# Altium schematic sheet car2.SchDoc
size A3; SheetNumber: 0; SheetTotal: 0; PageSetup: Record=PageOptions|CenterHorizontal=True|CenterVertical=True|PrintScale=0.73|XCorrection=1.00|YCorrection=1.00|PrintKind=2|BorderSize=5000000|LeftOffset=0|BottomOffset=0|Orientation=2|PaperLength=1000|PaperWidth=1000|Scale=100|PaperSource=7|PrintQuality=-4|MediaType=1|DitherType=10|PaperKind=A4|PrintScaleMode=1
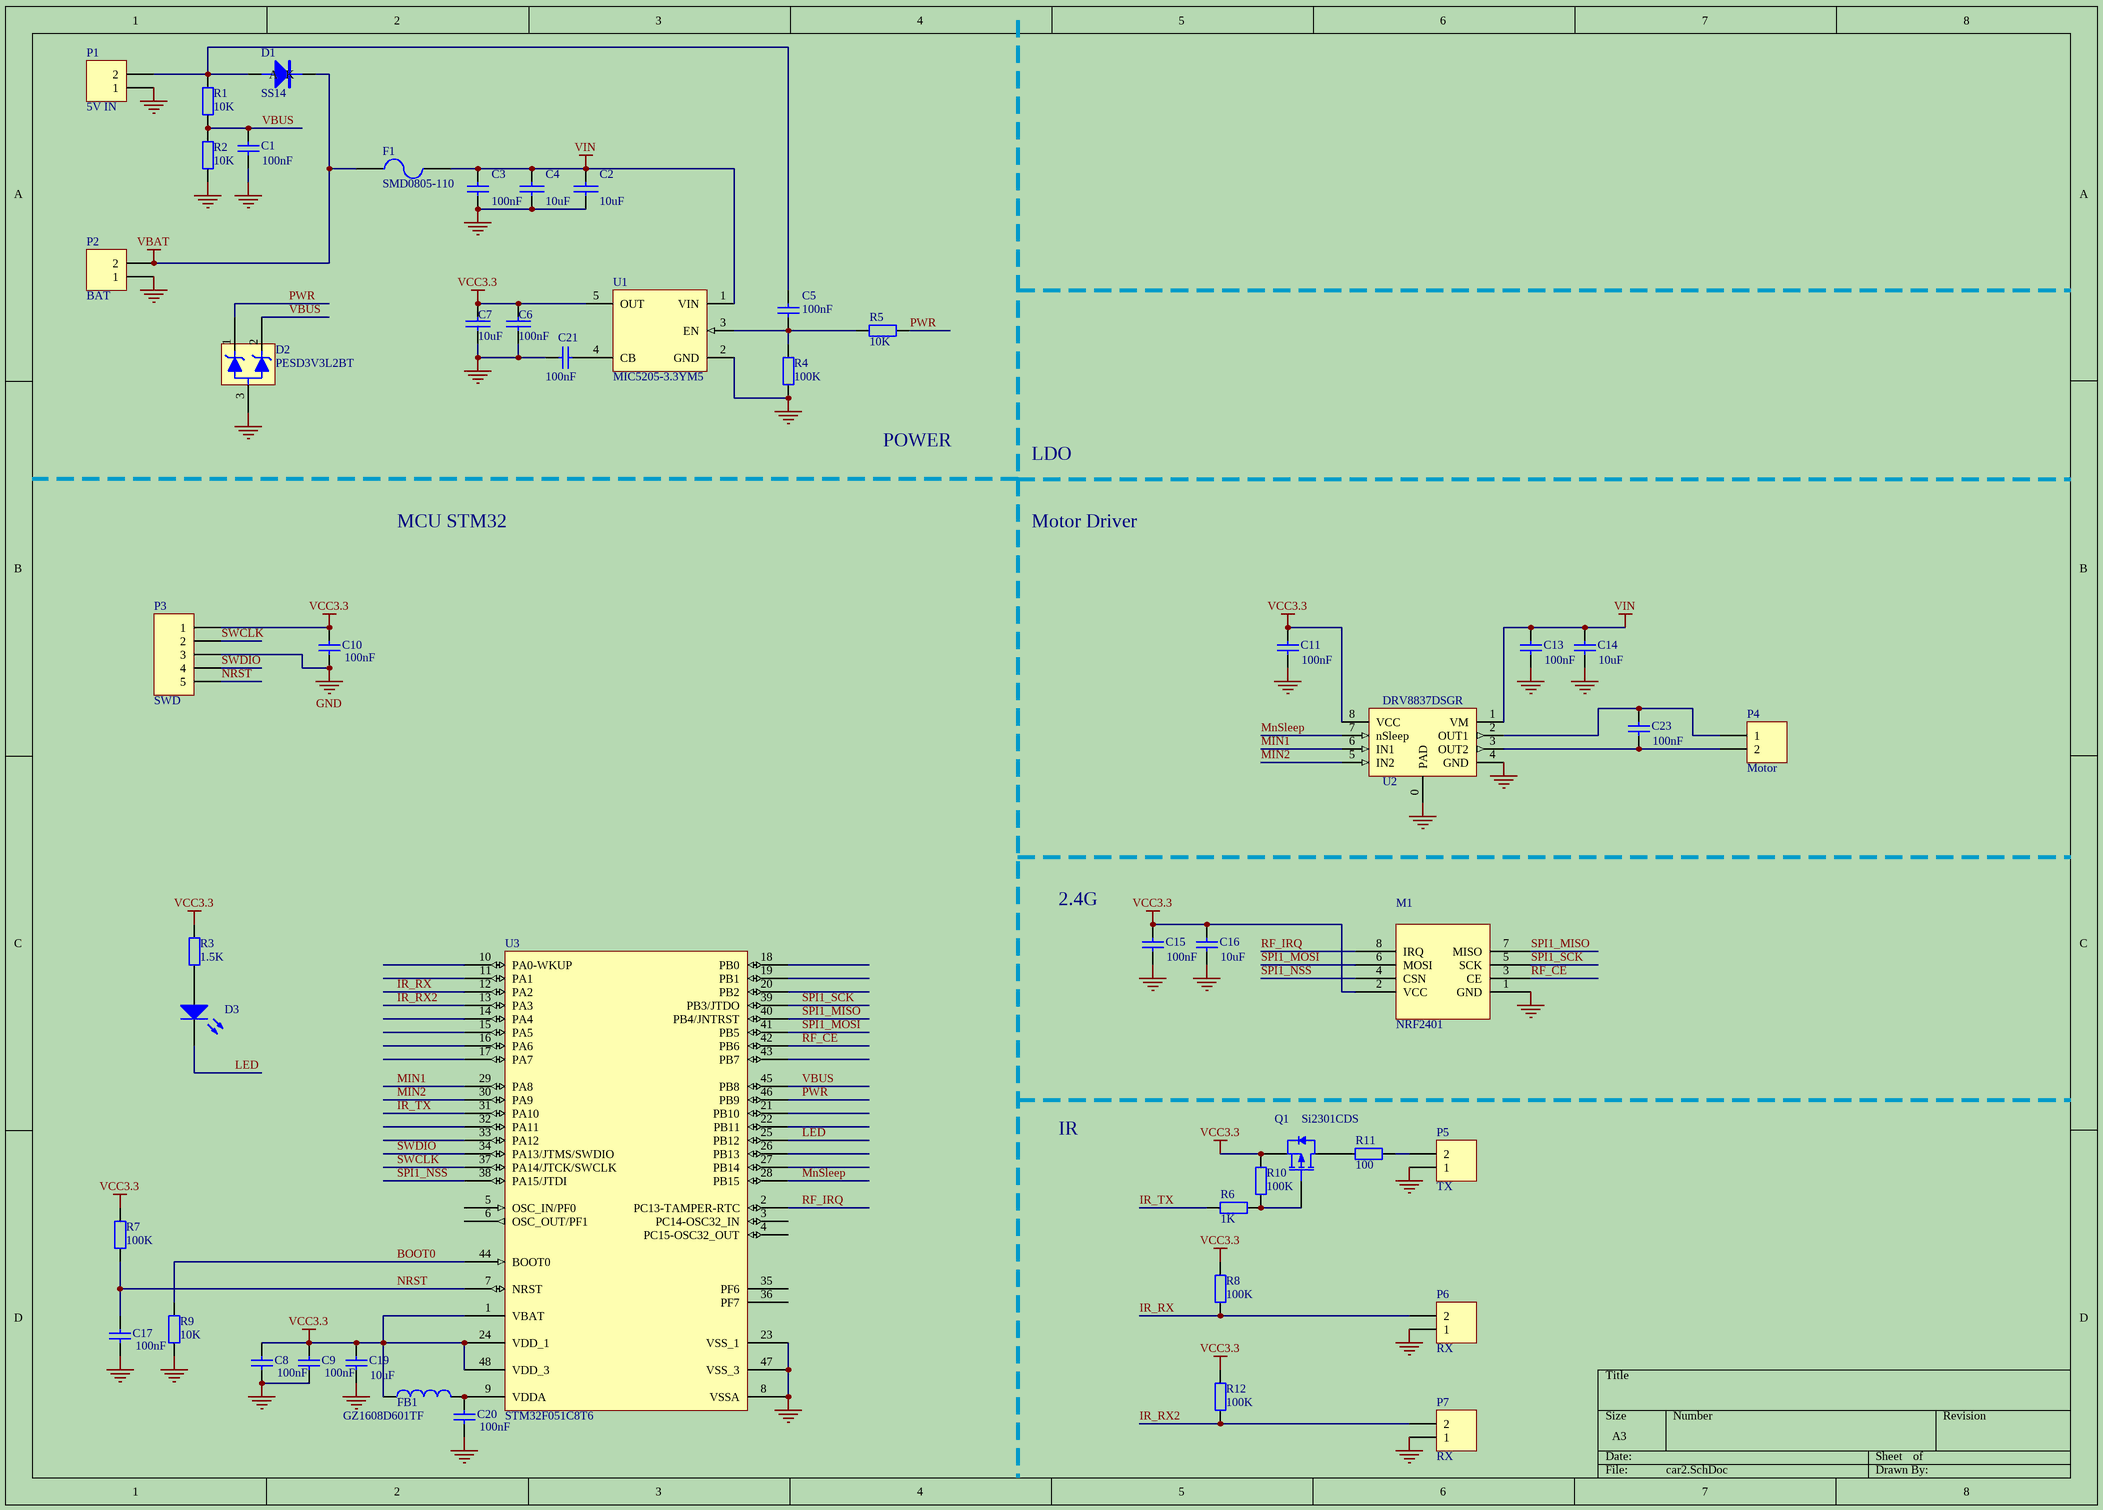
[diagram p0: car2.SchDoc]

## Parts
C1  100nF  [C0603]
C2  10uF  [C0805]
C3  100nF  [C0603]
C4  10uF  [C0805]
C5  100nF  [C0603]
C6  100nF  [C0603]
C7  10uF  [C0805]
C8  100nF  [C0603]
C9  100nF  [C0603]
C10  100nF  [C0603]
C11  100nF  [C0603]
C13  100nF  [C0603]
C14  10uF  [C0805]
C15  100nF  [C0603]
C16  10uF  [C0805]
C17  100nF  [C0603]
C19  10uF  [C0805]
C20  100nF  [C0603]
C21  100nF  [C0603]
C23  100nF  [C0603]
D1  SS14  [LC-SMA(DO-214AC)_S2]
D2  PESD3V3L2BT  [LC-SOT-23(SOT-23-3)]
D3  LEDV1  [LC-0603_LED_S4]  (value not drawn)
F1  SMD0805-110  [R0805]
FB1  GZ1608D601TF  [R0603]
M1  NRF2401  [HDR2X4]
P1  5V IN  [PH-2Y]
P2  BAT  [PH-2Y]
P3  SWD  [HDR1X5]
P4  Motor  [PH-2Y]
P5  TX  [PH-2Y]
P6  RX  [PH-2Y]
P7  RX  [PH-2Y]
Q1  Si2301CDS  [LC-SOT-23(SOT-23-3)]
R1  10K  [R0603]
R2  10K  [R0603]
R3  1.5K  [R0603]
R4  100K  [R0603]
R5  10K  [R0603]
R6  1K  [R0603]
R7  100K  [R0603]
R8  100K  [R0603]
R9  10K  [R0603]
R10  100K  [R0603]
R11  100  [R0603]
R12  100K  [R0603]
U1  MIC5205-3.3YM5  [LC-SOT-23-5]
U2  DRV8837DSGR  [LC-WSON-8_2x2mm - DRV8837]
U3  STM32F051C8T6  [LC-LQFP-48_7x7x05P]

## Nets
GND: C1.1 C2.2 C3.1 C4.2 C6.2 C7.2 C8.1 C9.1 C10.2 C11.1 C13.1 C14.1 C15.1 C16.1 C17.1 C19.1 C20.1 C21.2 D2.3 M1.1(GND) P1.1 P2.1 P3.3 P5.1 P6.1 P7.1 R2.1 R4.1 R9.1 U1.2(GND) U2.0(PAD) U2.4(GND) U3.8(VSSA) U3.23(VSS_1) U3.47(VSS_3)
VBAT: D1.2(K) F1.1 P2.2
VCC3.3: C6.1 C7.1 C8.2 C9.2 C10.1 C11.2 C15.2 C16.2 C19.2 FB1.1 M1.2(VCC) P3.1 Q1.2(S) R3.2 R7.2 R8.1 R10.1 R12.1 U1.5(OUT) U2.8(VCC) U3.1(VBAT) U3.24(VDD_1) U3.48(VDD_3)
VIN: C2.1 C3.2 C4.1 C13.2 C14.2 F1.2 U1.1(VIN) U2.1(VM)
BOOT0: R9.2 U3.44(BOOT0)
IR_RX: P6.2 R8.2 U3.12(PA2)
IR_RX2: P7.2 R12.2 U3.13(PA3)
IR_TX: R6.2 U3.31(PA10)
LED: D3.K U3.25(PB12)
MIN1: U2.6(IN1) U3.29(PA8)
MIN2: U2.5(IN2) U3.30(PA9)
MnSleep: U2.7(nSleep) U3.28(PB15)
NRST: C17.2 P3.5 R7.1 U3.7(NRST)
PWR: D2.1 R5.1 U3.46(PB9)
RF_CE: M1.3(CE) U3.42(PB6)
RF_IRQ: M1.8(IRQ) U3.2(PC13-TAMPER-RTC)
SPI1_MISO: M1.7(MISO) U3.40(PB4/JNTRST)
SPI1_MOSI: M1.6(MOSI) U3.41(PB5)
SPI1_NSS: M1.4(CSN) U3.38(PA15/JTDI)
SPI1_SCK: M1.5(SCK) U3.39(PB3/JTDO)
SWCLK: P3.2 U3.37(PA14/JTCK/SWCLK)
SWDIO: P3.4 U3.34(PA13/JTMS/SWDIO)
VBUS: C1.2 D2.2 R1.1 R2.2 U3.45(PB8)
NetC5_1: C5.1 R4.2 R5.2 U1.3(EN)
NetC5_2: C5.2 D1.1(A) P1.2 R1.2
NetC20_2: C20.2 FB1.2 U3.9(VDDA)
NetC21_1: C21.1 U1.4(CB)
NetC23_1: C23.1 P4.2 U2.3(OUT2)
NetC23_2: C23.2 P4.1 U2.2(OUT1)
NetD3_A: D3.A R3.1
NetP5_2: P5.2 R11.2
NetQ1_1: Q1.1(G) R6.1 R10.2
NetQ1_3: Q1.3(D) R11.1

Not connected (* = marked no-connect by the designer): U3 3(PC14-OSC32_IN) 4(PC15-OSC32_OUT) 5(OSC_IN/PF0) 6(OSC_OUT/PF1) 10(PA0-WKUP) 11(PA1) 14(PA4) 15(PA5) 16(PA6) 17(PA7) 18(PB0) 19(PB1) 20(PB2) 21(PB10) 22(PB11) 26(PB13) 27(PB14) 32(PA11) 33(PA12) 35(PF6) 36(PF7) 43(PB7)

## Notes on the sheet
- POWER
- LDO
- MCU STM32
- Motor Driver
- 2.4G
- IR

## Library data of the parts
C1 C3 C5 C11 C13-C16 C19 C23 = Cap: Capacitor; Value: 10uF/10V; Published: 8-Jun-2000; LatestRevisionDate: 17-Jul-2002; LatestRevisionNote: Re-released for DXP Platform.; PackageReference: RAD-0.3; Publisher: Altium Limited
C2 C4 C6 C7 = CAP: Capacitor
C8-C10 C17 C20 = Cap: Capacitor; Published: 8-Jun-2000; LatestRevisionDate: 17-Jul-2002; LatestRevisionNote: Re-released for DXP Platform.; PackageReference: RAD-0.3; Publisher: Altium Limited; Value: 100nF
C21 = Cap: Capacitor; Value: 100pF; Published: 8-Jun-2000; LatestRevisionDate: 17-Jul-2002; LatestRevisionNote: Re-released for DXP Platform.; PackageReference: RAD-0.3; Publisher: Altium Limited; PackageDescription: Radial Cap, Thru-Hole; 2 Leads; 0.3 in Pin Spacing
D1 = DIODE
D2 = ZENER2: TVS
D3 = LED2: Typical RED, GREEN, YELLOW, AMBER GaAs LED; Published: 8-Jun-2000; LatestRevisionDate: 17-Jul-2002; LatestRevisionNote: Re-released for DXP Platform.; PackageReference: 3.2X1.6X1.1; Publisher: Altium Limited; PackageDescription: SM LED; 2 Flat Leads; PackageVersion: Feb-2002
F1 = Fuse 2: Fuse; Published: 8-Jun-2000; LatestRevisionDate: 17-Jul-2002; LatestRevisionNote: Re-released for DXP Platform.; PackageReference: PIN-W2/E2.8; Publisher: Altium Limited; PackageDescription: Thru-Hole; 2 Leads
FB1 = INDUCTOR1
P1 P2 P4-P7 = Header 2: Header, 2-Pin; LatestRevisionDate: 17-Jul-2002; LatestRevisionNote: Re-released for DXP Platform.; Publisher: Altium Limited
P3 = Header 5: Header, 5-Pin; LatestRevisionDate: 17-Jul-2002; LatestRevisionNote: Re-released for DXP Platform.; Publisher: Altium Limited
Q1 = BSH201: P-channel Enhancement Mode MOSFET; Published: 17-Sep-2003; LatestRevisionDate: 12-Dec-2006; LatestRevisionNote: IPC-7351 Footprint Added.; DatasheetVersion: Aug-1998; PackageVersion: May-1999; PackageReference: SOT23; Publisher: Altium Limited; PackageDescription: 3-Pin SOT-23 Package 0.95 mm Pitch, 2.3 mm Lead Span; ComponentLink1Description: Manufacturer Link; ComponentLink1URL: http://www.semiconductors.philips.com/; ComponentLink2Description: Datasheet; ComponentLink2URL: http://www.semiconductors.philips.com/acrobat/datasheets/BSH201_3.pdf
R1-R5 = Res2: Resistor; Value: 1K; Published: 8-Jun-2000; LatestRevisionDate: 17-Jul-2002; LatestRevisionNote: Re-released for DXP Platform.; PackageReference: AXIAL-0.4; Publisher: Altium Limited
R6 R8 R10-R12 = Res2: Resistor; Value: 10K; Published: 8-Jun-2000; LatestRevisionDate: 17-Jul-2002; LatestRevisionNote: Re-released for DXP Platform.; PackageReference: AXIAL-0.4; Publisher: Altium Limited
R7 R9 = Res2: Resistor; Published: 8-Jun-2000; LatestRevisionDate: 17-Jul-2002; LatestRevisionNote: Re-released for DXP Platform.; PackageReference: AXIAL-0.4; Publisher: Altium Limited
  R7: Value: 100K
  R9: Value: 10K
U1 = MIC5205: 150mA Low-Noise LDO Regulator
U2 = DRV883x: Low-Voltage H-Bridge Driver
U3 = STM32F51C8T6: STM32 ARM-based 32-bit MCU with 64 Kbytes Flash, 48-pin LQFP, Industrial Temperature; Published: 30-May-2008; DatasheetVersion: rev6, Mar-2008; PackageVersion: Mar-2008; PackageReference: LQFP48; Publisher: Altium Limited; PackageDescription: 48-Pin Low-Profile Quad Flat Pack, 7 x 7 mm Body, 0.5 mm Pitch (LQFP48); ComponentLink1Description: Manufacturer Link; ComponentLink1URL: www.st.com/stm32; ComponentLink2Description: Datasheet; ComponentLink2URL: http://www.st.com/stonline/products/literature/ds/13586.pdf